# Altium schematic sheet Screw Terminal Schematic Sheet.SchDoc
size A4
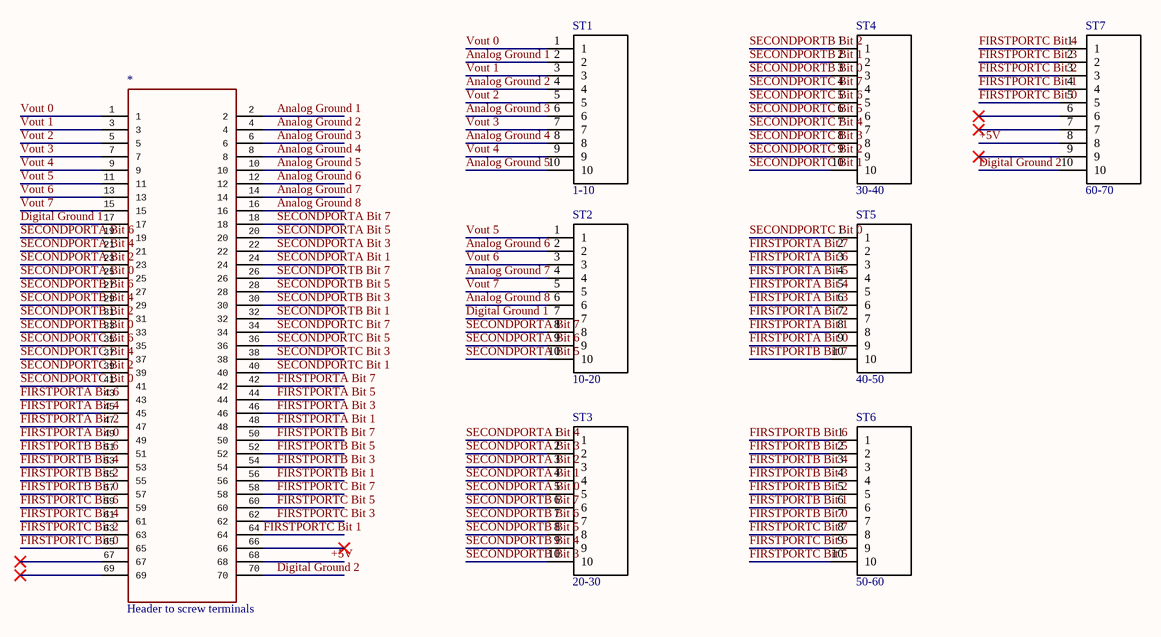
[diagram p0: Screw Terminal Schematic Sheet.SchDoc]

## Parts
*  Header to screw terminals  [Header]
ST1  1-10  [Screw Terminal]
ST2  10-20  [Screw Terminal]
ST3  20-30  [Screw Terminal]
ST4  30-40  [Screw Terminal]
ST5  40-50  [Screw Terminal]
ST6  50-60  [Screw Terminal]
ST7  60-70  [Screw Terminal]

## Nets
+5V: *.68 ST7.8
Analog Ground 1: *.2 ST1.2
Analog Ground 2: *.4 ST1.4
Analog Ground 3: *.6 ST1.6
Analog Ground 4: *.8 ST1.8
Analog Ground 5: *.10 ST1.10
Analog Ground 6: *.12 ST2.2
Analog Ground 7: *.14 ST2.4
Analog Ground 8: *.16 ST2.6
Digital Ground 1: *.17 ST2.7
Digital Ground 2: *.70 ST7.10
FIRSTPORTA Bit 0: *.49 ST5.9
FIRSTPORTA Bit 1: *.48 ST5.8
FIRSTPORTA Bit 2: *.47 ST5.7
FIRSTPORTA Bit 3: *.46 ST5.6
FIRSTPORTA Bit 4: *.45 ST5.5
FIRSTPORTA Bit 5: *.44 ST5.4
FIRSTPORTA Bit 6: *.43 ST5.3
FIRSTPORTA Bit 7: *.42 ST5.2
FIRSTPORTB Bit 0: *.57 ST6.7
FIRSTPORTB Bit 1: *.56 ST6.6
FIRSTPORTB Bit 2: *.55 ST6.5
FIRSTPORTB Bit 3: *.54 ST6.4
FIRSTPORTB Bit 4: *.53 ST6.3
FIRSTPORTB Bit 5: *.52 ST6.2
FIRSTPORTB Bit 6: *.51 ST6.1
FIRSTPORTB Bit 7: *.50 ST5.10
FIRSTPORTC Bit 0: *.65 ST7.5
FIRSTPORTC Bit 1: *.64 ST7.4
FIRSTPORTC Bit 2: *.63 ST7.3
FIRSTPORTC Bit 3: *.62 ST7.2
FIRSTPORTC Bit 4: *.61 ST7.1
FIRSTPORTC Bit 5: *.60 ST6.10
FIRSTPORTC Bit 6: *.59 ST6.9
FIRSTPORTC Bit 7: *.58 ST6.8
SECONDPORTA Bit 0: *.25 ST3.5
SECONDPORTA Bit 1: *.24 ST3.4
SECONDPORTA Bit 2: *.23 ST3.3
SECONDPORTA Bit 3: *.22 ST3.2
SECONDPORTA Bit 4: *.21 ST3.1
SECONDPORTA Bit 5: *.20 ST2.10
SECONDPORTA Bit 6: *.19 ST2.9
SECONDPORTA Bit 7: *.18 ST2.8
SECONDPORTB Bit 0: *.33 ST4.3
SECONDPORTB Bit 1: *.32 ST4.2
SECONDPORTB Bit 2: *.31 ST4.1
SECONDPORTB Bit 3: *.30 ST3.10
SECONDPORTB Bit 4: *.29 ST3.9
SECONDPORTB Bit 5: *.28 ST3.8
SECONDPORTB Bit 6: *.27 ST3.7
SECONDPORTB Bit 7: *.26 ST3.6
SECONDPORTC Bit 0: *.41 ST5.1
SECONDPORTC Bit 1: *.40 ST4.10
SECONDPORTC Bit 2: *.39 ST4.9
SECONDPORTC Bit 3: *.38 ST4.8
SECONDPORTC Bit 4: *.37 ST4.7
SECONDPORTC Bit 5: *.36 ST4.6
SECONDPORTC Bit 6: *.35 ST4.5
SECONDPORTC Bit 7: *.34 ST4.4
Vout 0: *.1 ST1.1
Vout 1: *.3 ST1.3
Vout 2: *.5 ST1.5
Vout 3: *.7 ST1.7
Vout 4: *.9 ST1.9
Vout 5: *.11 ST2.1
Vout 6: *.13 ST2.3
Vout 7: *.15 ST2.5

Not connected (* = marked no-connect by the designer): * 66* 67* 69*; ST7 6* 7* 9*

## Library data of the parts
* = Header
ST1-ST7 = Screw Terminal